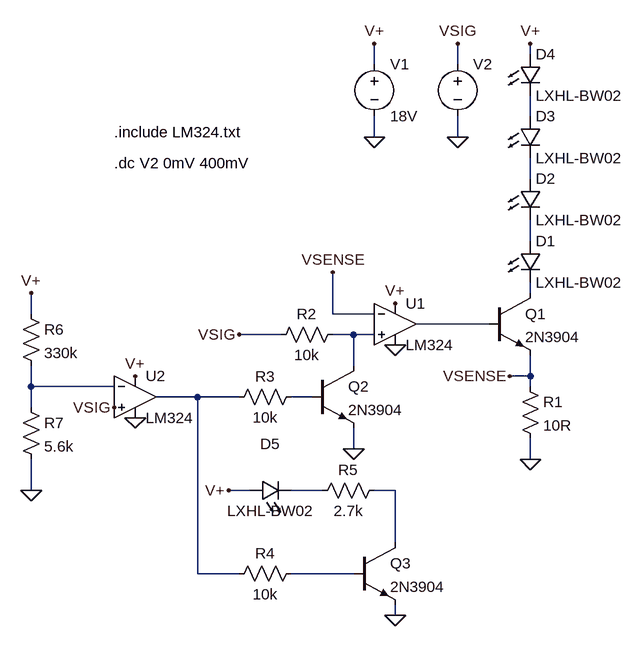
[diagram p0: schematic driver_option1.asc]
driver_option1.asc, the LTspice schematic file:
Version 4
SHEET 1 1136 724
WIRE 400 -384 400 -400
WIRE 160 -368 160 -400
WIRE 288 -368 288 -400
WIRE 400 -288 400 -320
WIRE 160 -256 160 -288
WIRE 288 -256 288 -288
WIRE 400 -192 400 -224
WIRE 400 -96 400 -128
WIRE 400 -16 400 -32
WIRE -368 16 -368 -16
WIRE 96 16 96 -48
WIRE 160 16 96 16
WIRE 336 32 224 32
WIRE 16 48 -48 48
WIRE 128 48 96 48
WIRE 160 48 128 48
WIRE 128 96 128 48
WIRE 400 112 400 80
WIRE 400 112 368 112
WIRE -368 128 -368 96
WIRE -240 128 -368 128
WIRE 400 128 400 112
WIRE -112 144 -176 144
WIRE -48 144 -112 144
WIRE 64 144 32 144
WIRE -368 160 -368 128
WIRE 128 224 128 192
WIRE 400 240 400 208
WIRE -368 288 -368 240
WIRE -32 288 -64 288
WIRE 80 288 32 288
WIRE 192 288 160 288
WIRE 192 368 192 288
WIRE -112 416 -112 144
WIRE -48 416 -112 416
WIRE 128 416 32 416
WIRE 192 480 192 464
FLAG 160 -256 0
FLAG 160 -400 V+
FLAG 192 0 V+
FLAG 192 64 0
FLAG 288 -400 VSIG
FLAG 288 -256 0
FLAG 400 -400 V+
FLAG 400 240 0
FLAG -48 48 VSIG
FLAG -240 160 VSIG
FLAG -208 112 V+
FLAG -208 176 0
FLAG 128 224 0
FLAG -64 288 V+
FLAG 192 480 0
FLAG 368 112 VSENSE
FLAG 96 -48 VSENSE
FLAG -368 288 0
FLAG -368 -16 V+
SYMBOL Opamps\\opamp2 192 -32 R0
SYMATTR InstName U1
SYMATTR Value LM324
SYMBOL voltage 160 -384 R0
WINDOW 123 0 0 Left 2
WINDOW 39 0 0 Left 2
SYMATTR InstName V1
SYMATTR Value 18V
SYMBOL npn 336 -16 R0
SYMATTR InstName Q1
SYMATTR Value 2N3904
SYMBOL voltage 288 -384 R0
WINDOW 3 24 44 Left 2
WINDOW 123 0 0 Left 2
WINDOW 39 24 44 Left 2
SYMATTR Value ""
SYMATTR InstName V2
SYMBOL LED 384 -96 R0
SYMATTR InstName D1
SYMATTR Value LXHL-BW02
SYMBOL res 384 112 R0
SYMATTR InstName R1
SYMATTR Value 10R
SYMBOL LED 384 -192 R0
SYMATTR InstName D2
SYMATTR Value LXHL-BW02
SYMBOL LED 384 -288 R0
SYMATTR InstName D3
SYMATTR Value LXHL-BW02
SYMBOL LED 384 -384 R0
SYMATTR InstName D4
SYMATTR Value LXHL-BW02
SYMBOL Opamps\\opamp2 -208 80 R0
SYMATTR InstName U2
SYMATTR Value LM324
SYMBOL npn 64 96 R0
SYMATTR InstName Q2
SYMATTR Value 2N3904
SYMBOL res 112 32 R90
WINDOW 0 0 56 VBottom 2
WINDOW 3 32 56 VTop 2
SYMATTR InstName R2
SYMATTR Value 10k
SYMBOL npn 128 368 R0
SYMATTR InstName Q3
SYMATTR Value 2N3904
SYMBOL LED -32 304 R270
WINDOW 0 72 32 VTop 2
WINDOW 3 0 32 VBottom 2
SYMATTR InstName D5
SYMATTR Value LXHL-BW02
SYMBOL res 64 304 R270
WINDOW 0 32 56 VTop 2
WINDOW 3 0 56 VBottom 2
SYMATTR InstName R5
SYMATTR Value 2.7k
SYMBOL res -384 0 R0
SYMATTR InstName R6
SYMATTR Value 330k
SYMBOL res -384 144 R0
SYMATTR InstName R7
SYMATTR Value 5.6k
SYMBOL res 48 128 R90
WINDOW 0 0 56 VBottom 2
WINDOW 3 32 56 VTop 2
SYMATTR InstName R3
SYMATTR Value 10k
SYMBOL res 48 400 R90
WINDOW 0 0 56 VBottom 2
WINDOW 3 32 56 VTop 2
SYMATTR InstName R4
SYMATTR Value 10k
TEXT -240 -264 Left 2 !.include LM324.txt
TEXT -240 -216 Left 2 !.dc V2 0mV 400mV

The netlist it stands for:
* driver_option1.asc
XU1 N006 VSENSE V+ 0 N005 LM324  ; pins In+ In- V+ V- OUT
V1 V+ 0 18V
Q1 N004 N005 VSENSE 0 2N3904
V2 VSIG 0
D1 N003 N004 LXHL-BW02
R1 VSENSE 0 10R
D2 N002 N003 LXHL-BW02
D3 N001 N002 LXHL-BW02
D4 V+ N001 LXHL-BW02
XU2 VSIG N007 V+ 0 N008 LM324  ; pins In+ In- V+ V- OUT
Q2 N006 N009 0 0 2N3904
R2 N006 VSIG 10k
Q3 N011 N012 0 0 2N3904
D5 V+ N010 LXHL-BW02
R5 N010 N011 2.7k
R6 V+ N007 330k
R7 N007 0 5.6k
R3 N009 N008 10k
R4 N012 N008 10k
.model D D
.lib standard.dio
.model NPN NPN
.model PNP PNP
.lib standard.bjt
.include LM324.txt
.dc V2 0mV 400mV
.backanno
.end